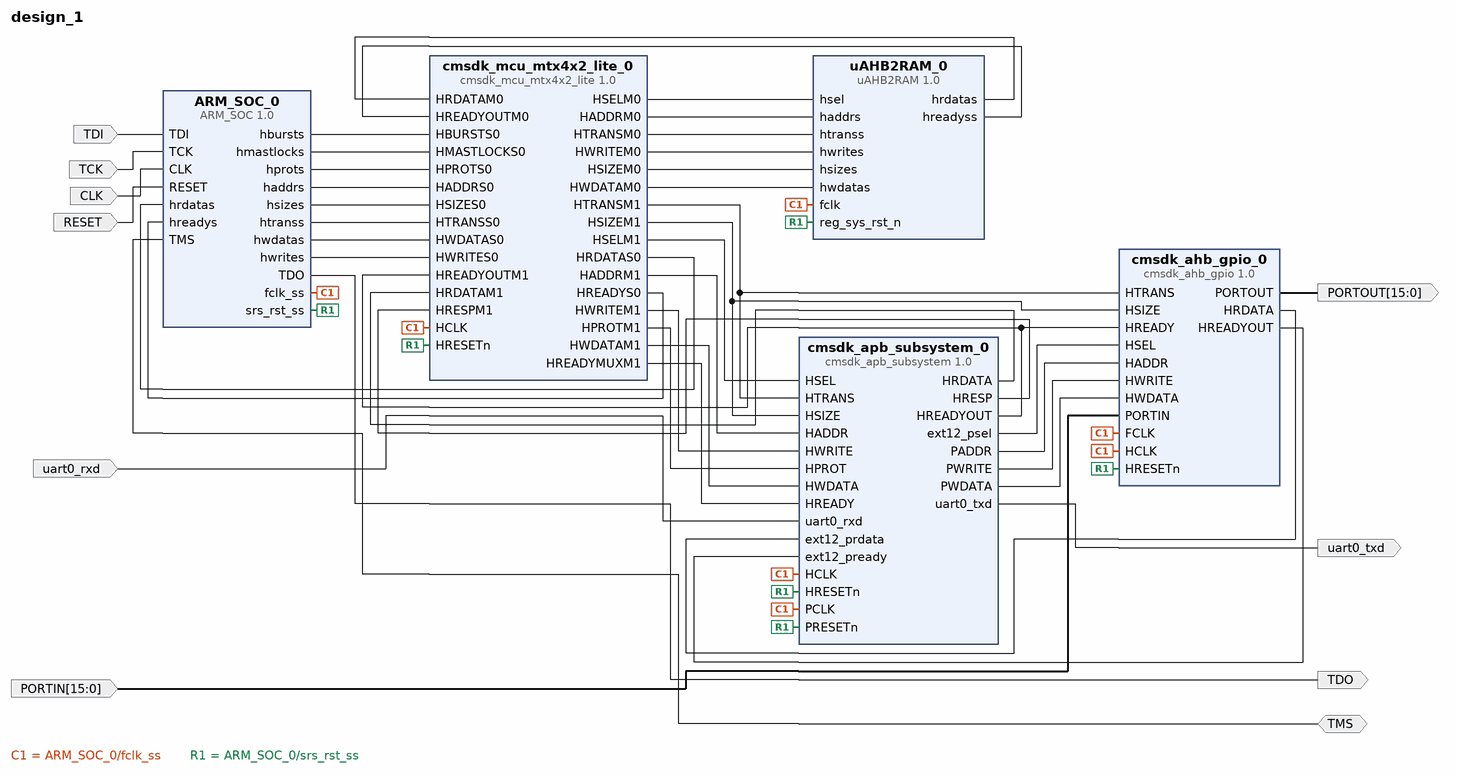
[diagram p0: block diagram of the top level]
# Vivado block design design_1, xc7a100tcsg324-1, Vivado 2018.1
create_bd_design design_1

create_bd_port -dir I TDI
create_bd_port -dir I TCK
create_bd_port -dir IO TMS
create_bd_port -dir O TDO
create_bd_port -dir I -from 15 -to 0 PORTIN
create_bd_port -dir O -from 15 -to 0 PORTOUT
create_bd_port -dir I uart0_rxd
create_bd_port -dir O uart0_txd
create_bd_port -dir I -type clk CLK
set_property -dict {CONFIG.FREQ_HZ 100000000 CONFIG.PHASE 0.0 CONFIG.CLK_DOMAIN /clk_wiz_clk_out1} [get_bd_ports CLK]
create_bd_port -dir I -type rst RESET

create_bd_cell -type ip -vlnv xilinx.com:user:ARM_SOC:1.0 ARM_SOC_0
create_bd_cell -type ip -vlnv xilinx.com:user:cmsdk_mcu_mtx4x2_lite:1.0 cmsdk_mcu_mtx4x2_lite_0
create_bd_cell -type ip -vlnv xilinx.com:user:uAHB2RAM:1.0 uAHB2RAM_0
create_bd_cell -type ip -vlnv xilinx.com:user:cmsdk_apb_subsystem:1.0 cmsdk_apb_subsystem_0
create_bd_cell -type ip -vlnv xilinx.com:user:cmsdk_ahb_gpio:1.0 cmsdk_ahb_gpio_0

# ---- connections ----

connect_bd_net [get_bd_ports TDI] [get_bd_pins ARM_SOC_0/TDI]
connect_bd_net [get_bd_ports TCK] [get_bd_pins ARM_SOC_0/TCK]
connect_bd_net [get_bd_ports TMS] [get_bd_pins ARM_SOC_0/TMS]
connect_bd_net [get_bd_pins ARM_SOC_0/TDO] [get_bd_ports TDO]
connect_bd_net [get_bd_pins ARM_SOC_0/hbursts] [get_bd_pins cmsdk_mcu_mtx4x2_lite_0/HBURSTS0]
connect_bd_net [get_bd_pins ARM_SOC_0/hmastlocks] [get_bd_pins cmsdk_mcu_mtx4x2_lite_0/HMASTLOCKS0]
connect_bd_net [get_bd_pins ARM_SOC_0/hprots] [get_bd_pins cmsdk_mcu_mtx4x2_lite_0/HPROTS0]
connect_bd_net [get_bd_pins ARM_SOC_0/haddrs] [get_bd_pins cmsdk_mcu_mtx4x2_lite_0/HADDRS0]
connect_bd_net [get_bd_pins ARM_SOC_0/hsizes] [get_bd_pins cmsdk_mcu_mtx4x2_lite_0/HSIZES0]
connect_bd_net [get_bd_pins ARM_SOC_0/htranss] [get_bd_pins cmsdk_mcu_mtx4x2_lite_0/HTRANSS0]
connect_bd_net [get_bd_pins ARM_SOC_0/hwdatas] [get_bd_pins cmsdk_mcu_mtx4x2_lite_0/HWDATAS0]
connect_bd_net [get_bd_pins ARM_SOC_0/hwrites] [get_bd_pins cmsdk_mcu_mtx4x2_lite_0/HWRITES0]
connect_bd_net [get_bd_pins cmsdk_mcu_mtx4x2_lite_0/HRDATAS0] [get_bd_pins ARM_SOC_0/hrdatas]
connect_bd_net [get_bd_pins cmsdk_mcu_mtx4x2_lite_0/HREADYS0] [get_bd_pins ARM_SOC_0/hreadys]
connect_bd_net [get_bd_pins ARM_SOC_0/fclk_ss] \
  [get_bd_pins cmsdk_mcu_mtx4x2_lite_0/HCLK] [get_bd_pins uAHB2RAM_0/fclk] [get_bd_pins cmsdk_apb_subsystem_0/HCLK] \
  [get_bd_pins cmsdk_ahb_gpio_0/HCLK] [get_bd_pins cmsdk_ahb_gpio_0/FCLK] [get_bd_pins cmsdk_apb_subsystem_0/PCLK]
connect_bd_net [get_bd_pins ARM_SOC_0/srs_rst_ss] \
  [get_bd_pins cmsdk_mcu_mtx4x2_lite_0/HRESETn] [get_bd_pins uAHB2RAM_0/reg_sys_rst_n] \
  [get_bd_pins cmsdk_apb_subsystem_0/HRESETn] [get_bd_pins cmsdk_ahb_gpio_0/HRESETn] \
  [get_bd_pins cmsdk_apb_subsystem_0/PRESETn]
connect_bd_net [get_bd_pins cmsdk_mcu_mtx4x2_lite_0/HSELM0] [get_bd_pins uAHB2RAM_0/hsel]
connect_bd_net [get_bd_pins cmsdk_mcu_mtx4x2_lite_0/HADDRM0] [get_bd_pins uAHB2RAM_0/haddrs]
connect_bd_net [get_bd_pins cmsdk_mcu_mtx4x2_lite_0/HTRANSM0] [get_bd_pins uAHB2RAM_0/htranss]
connect_bd_net [get_bd_pins cmsdk_mcu_mtx4x2_lite_0/HWRITEM0] [get_bd_pins uAHB2RAM_0/hwrites]
connect_bd_net [get_bd_pins cmsdk_mcu_mtx4x2_lite_0/HSIZEM0] [get_bd_pins uAHB2RAM_0/hsizes]
connect_bd_net [get_bd_pins cmsdk_mcu_mtx4x2_lite_0/HWDATAM0] [get_bd_pins uAHB2RAM_0/hwdatas]
connect_bd_net [get_bd_pins uAHB2RAM_0/hrdatas] [get_bd_pins cmsdk_mcu_mtx4x2_lite_0/HRDATAM0]
connect_bd_net [get_bd_pins uAHB2RAM_0/hreadyss] [get_bd_pins cmsdk_mcu_mtx4x2_lite_0/HREADYOUTM0]
connect_bd_net [get_bd_pins cmsdk_mcu_mtx4x2_lite_0/HSELM1] [get_bd_pins cmsdk_apb_subsystem_0/HSEL]
connect_bd_net [get_bd_pins cmsdk_mcu_mtx4x2_lite_0/HADDRM1] [get_bd_pins cmsdk_apb_subsystem_0/HADDR]
connect_bd_net [get_bd_pins cmsdk_mcu_mtx4x2_lite_0/HTRANSM1] [get_bd_pins cmsdk_apb_subsystem_0/HTRANS] [get_bd_pins cmsdk_ahb_gpio_0/HTRANS]
connect_bd_net [get_bd_pins cmsdk_mcu_mtx4x2_lite_0/HWRITEM1] [get_bd_pins cmsdk_apb_subsystem_0/HWRITE]
connect_bd_net [get_bd_pins cmsdk_mcu_mtx4x2_lite_0/HSIZEM1] [get_bd_pins cmsdk_apb_subsystem_0/HSIZE] [get_bd_pins cmsdk_ahb_gpio_0/HSIZE]
connect_bd_net [get_bd_pins cmsdk_mcu_mtx4x2_lite_0/HPROTM1] [get_bd_pins cmsdk_apb_subsystem_0/HPROT]
connect_bd_net [get_bd_pins cmsdk_mcu_mtx4x2_lite_0/HWDATAM1] [get_bd_pins cmsdk_apb_subsystem_0/HWDATA]
connect_bd_net [get_bd_pins cmsdk_apb_subsystem_0/HREADYOUT] [get_bd_pins cmsdk_mcu_mtx4x2_lite_0/HREADYOUTM1] [get_bd_pins cmsdk_ahb_gpio_0/HREADY]
connect_bd_net [get_bd_pins cmsdk_apb_subsystem_0/HRDATA] [get_bd_pins cmsdk_mcu_mtx4x2_lite_0/HRDATAM1]
connect_bd_net [get_bd_pins cmsdk_apb_subsystem_0/HRESP] [get_bd_pins cmsdk_mcu_mtx4x2_lite_0/HRESPM1]
connect_bd_net [get_bd_pins cmsdk_mcu_mtx4x2_lite_0/HREADYMUXM1] [get_bd_pins cmsdk_apb_subsystem_0/HREADY]
connect_bd_net [get_bd_pins cmsdk_apb_subsystem_0/ext12_psel] [get_bd_pins cmsdk_ahb_gpio_0/HSEL]
connect_bd_net [get_bd_pins cmsdk_apb_subsystem_0/PADDR] [get_bd_pins cmsdk_ahb_gpio_0/HADDR]
connect_bd_net [get_bd_pins cmsdk_apb_subsystem_0/PWRITE] [get_bd_pins cmsdk_ahb_gpio_0/HWRITE]
connect_bd_net [get_bd_pins cmsdk_apb_subsystem_0/PWDATA] [get_bd_pins cmsdk_ahb_gpio_0/HWDATA]
connect_bd_net [get_bd_pins cmsdk_ahb_gpio_0/HRDATA] [get_bd_pins cmsdk_apb_subsystem_0/ext12_prdata]
connect_bd_net [get_bd_pins cmsdk_ahb_gpio_0/HREADYOUT] [get_bd_pins cmsdk_apb_subsystem_0/ext12_pready]
connect_bd_net [get_bd_ports PORTIN] [get_bd_pins cmsdk_ahb_gpio_0/PORTIN]
connect_bd_net [get_bd_pins cmsdk_ahb_gpio_0/PORTOUT] [get_bd_ports PORTOUT]
connect_bd_net [get_bd_ports uart0_rxd] [get_bd_pins cmsdk_apb_subsystem_0/uart0_rxd]
connect_bd_net [get_bd_pins cmsdk_apb_subsystem_0/uart0_txd] [get_bd_ports uart0_txd]
connect_bd_net [get_bd_ports CLK] [get_bd_pins ARM_SOC_0/CLK]
connect_bd_net [get_bd_ports RESET] [get_bd_pins ARM_SOC_0/RESET]

validate_bd_design
save_bd_design
